# Altium schematic sheet Motors.SchDoc
size OrCAD A
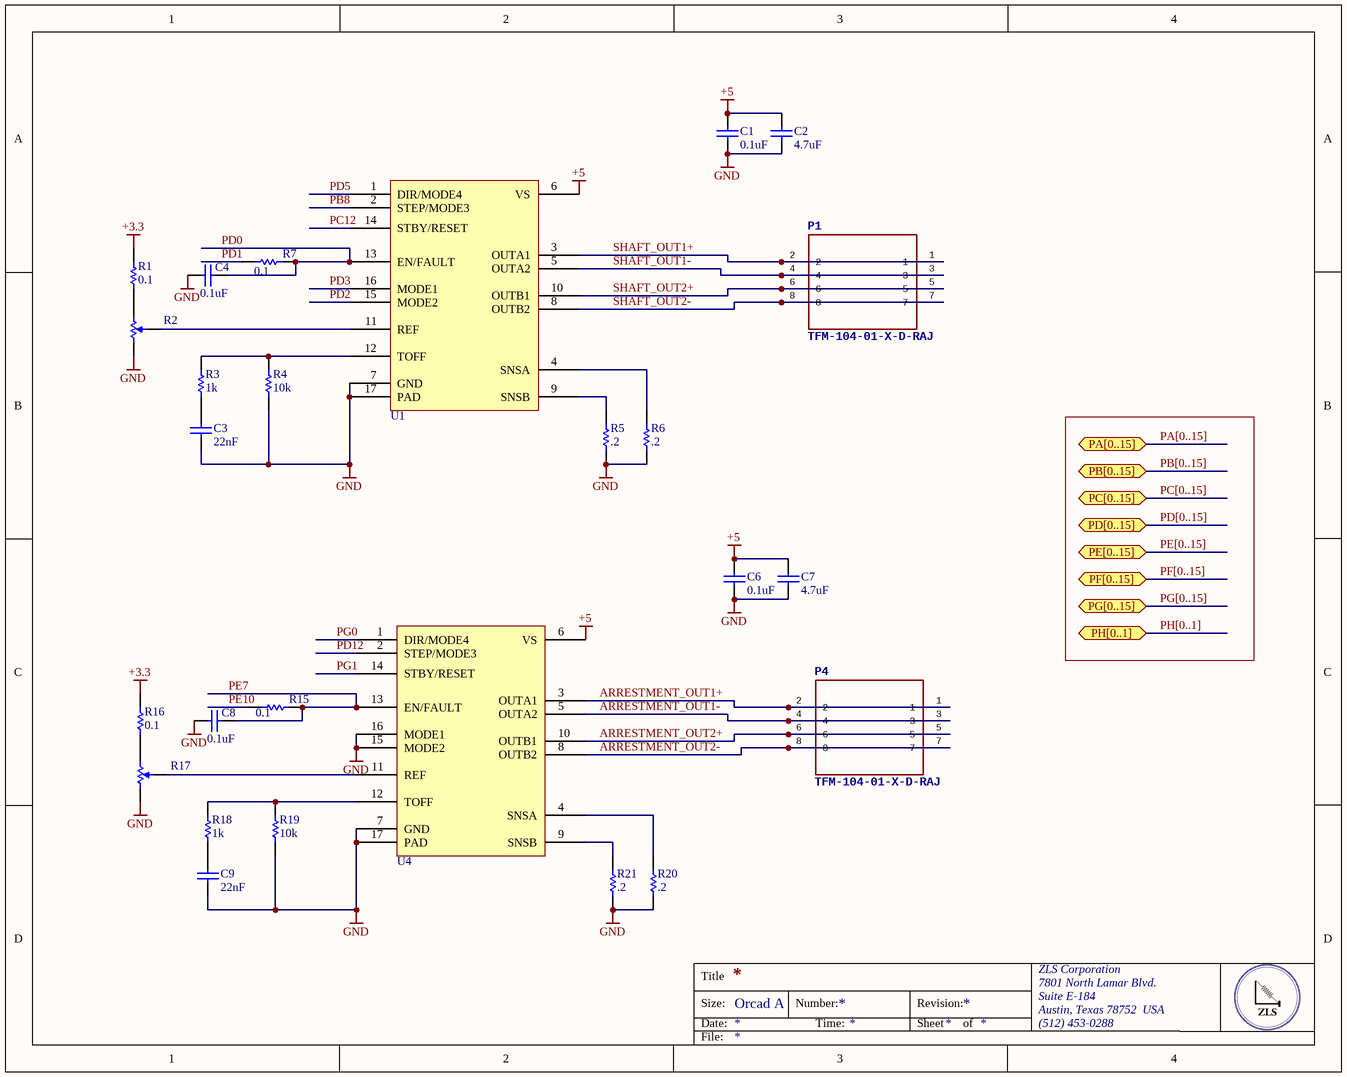
[diagram p0: Motors.SchDoc]

## Parts
C1  0.1uF  [CAPC1608X94X35LL15T15]
C2  4.7uF  [CAPC0603(1608)55_M]
C3  22nF  [CAPC1608X94X35LL15T15]
C4  0.1uF  [CAPC1608X94X35LL15T15]
C6  0.1uF  [CAPC1608X94X35LL15T15]
C7  4.7uF  [CAPC0603(1608)55_M]
C8  0.1uF  [CAPC1608X94X35LL15T15]
C9  22nF  [CAPC1608X94X35LL15T15]
P1  TFM-104-01-X-D-RAJ  [SAMTEC-TFM-104-01-X-D-RA]
P4  TFM-104-01-X-D-RAJ  [SAMTEC-TFM-104-01-X-D-RA]
R1  0.1  [RESC0603(1608)_N]
R2  3313J-1-503E  [BOUR-3313J-1_V]  (value not drawn)
R3  1k  [RESC0603(1608)_N]
R4  10k  [RESC0603(1608)_N]
R5  .2  [RESC0603(1608)_N]
R6  .2  [RESC0603(1608)_N]
R7  0.1  [RESC0603(1608)_N]
R15  0.1  [RESC0603(1608)_N]
R16  0.1  [RESC0603(1608)_N]
R17  3313J-1-503E  [BOUR-3313J-1_V]  (value not drawn)
R18  1k  [RESC0603(1608)_N]
R19  10k  [RESC0603(1608)_N]
R20  .2  [RESC0603(1608)_N]
R21  .2  [RESC0603(1608)_N]
U1  STSPIN220  [STSPIN220-QFN127P600-8N]  (value not drawn)
U4  STSPIN220  [STSPIN220-QFN127P600-8N]  (value not drawn)

## Ports
PA[0..15] (bidir), PB[0..15] (bidir), PC[0..15] (bidir), PD[0..15] (bidir), PE[0..15] (bidir), PF[0..15] (bidir), PG[0..15] (bidir), PH[0..1] (bidir)

## Nets
+3.3: R1.1 R16.1
+5: C1.1 C2.2 C6.1 C7.2 U1.6(VS) U4.6(VS)
GND: C1.2 C2.1 C3.2 C4.1 C6.2 C7.1 C8.1 C9.2 R2.1 R4.1 R5.1 R6.1 R17.1 R19.1 R20.1 R21.1 U1.7(GND) U1.17(PAD) U4.7(GND) U4.15(MODE2) U4.16(MODE1) U4.17(PAD)
ARRESTMENT_OUT1+: P4.1 P4.2 U4.3(OUTA1)
ARRESTMENT_OUT1-: P4.3 P4.4 U4.5(OUTA2)
ARRESTMENT_OUT2+: P4.5 P4.6 U4.10(OUTB1)
ARRESTMENT_OUT2-: P4.7 P4.8 U4.8(OUTB2)
PB8: U1.2(STEP/MODE3)
PC12: U1.14(STBY/RESET)
PD0: C4.2 R7.1 U1.13(EN/FAULT)
PD1: R7.2
PD2: U1.15(MODE2)
PD3: U1.16(MODE1)
PD5: U1.1(DIR/MODE4)
PD12: U4.2(STEP/MODE3)
PE7: C8.2 R15.1 U4.13(EN/FAULT)
PE10: R15.2
PG0: U4.1(DIR/MODE4)
PG1: U4.14(STBY/RESET)
SHAFT_OUT1+: P1.1 P1.2 U1.3(OUTA1)
SHAFT_OUT1-: P1.3 P1.4 U1.5(OUTA2)
SHAFT_OUT2+: P1.5 P1.6 U1.10(OUTB1)
SHAFT_OUT2-: P1.7 P1.8 U1.8(OUTB2)
NetC3_1: C3.1 R3.1
NetC9_1: C9.1 R18.1
NetR1_2: R1.2 R2.3
NetR2_2: R2.2 U1.11(REF)
NetR3_2: R3.2 R4.2 U1.12(TOFF)
NetR5_2: R5.2 U1.9(SNSB)
NetR6_2: R6.2 U1.4(SNSA)
NetR16_2: R16.2 R17.3
NetR17_2: R17.2 U4.11(REF)
NetR18_2: R18.2 R19.2 U4.12(TOFF)
NetR20_2: R20.2 U4.4(SNSA)
NetR21_2: R21.2 U4.9(SNSB)

## Buses and harness runs
bus PA[0..15] = port PA[0..15]
bus PB[0..15] = port PB[0..15]
bus PC[0..15] = port PC[0..15]
bus PD[0..15] = port PD[0..15]
bus PE[0..15] = port PE[0..15]
bus PF[0..15] = port PF[0..15]
bus PG[0..15] = port PG[0..15]
bus PH[0..1] = port PH[0..1]

## Notes on the sheet
- Title
- Size:
- Date:
- Orcad A
- Number:
- Time:
- Revision:
- Sheet
- of
- ZLS Corporation
- 7801 North Lamar Blvd.
- Suite E-184
- Austin, Texas 78752  USA
- (512) 453-0288
- File:

## Library data of the parts
C1 C3 C4 C6 C8 C9 = CMP-1661-00001-2: CAP .1UF 16V CERAMIC X7R 0603; Manufacturer: Yageo; Manufacturer Part Number: CC0603KRX7R7BB105; Capacitance: 1uF; Tolerance: 10%; Dissipation Factor: 5%; ComponentLink1Description: Datasheet; ComponentLink1URL: http://datasheets.avx.com/X7RDielectric.pdf; Supplier 1: Digi-Key; Supplier Part Number 1: 311-1446-6-ND; Stock 1: 5506121; Pricing 1: 1=0.21, 10=0.143, 100=0.0727, 500=0.04974, 1000=0.044 (USD); Mount: Surface Mount; Case/Package: 0603; Number of Pins: 2; Case Code (Metric): 1608; Case Code (Imperial): 0603; Min Operating Temperature: -55°C; Max Operating Temperature: 125°C; Voltage Rating: 16V; Package Quantity: 1; Packaging: Tape and Reel; Voltage Rating (DC): 16V; Dielectric: X7R; Termination: SMD/SMT; Voltage: 16V; Composition: Ceramic; Length: 1.6mm; Height: 0.8mm; Width: 0.031inch; Thickness: 0.035inch; Depth: 0.8mm; Radiation Hardening: No; REACH SVHC: Unknown; Lead Free: Lead Free; Halogen Free: Halogen Free; ComponentLink2URL: http://www.yageo.com/documents/recent/UPY-GPHC_X7R_6.3V-to-50V_18.pdf; ComponentLink2Description: http://www.yageo.com/documents/recent/UPY-GPHC_X7R_6.3V-to-50V_18.pdf; ComponentLink3URL: http://www.yageo.com/documents/recent/UPY-GPHC_X7R_6.3V-to-50V_8.pdf; ComponentLink3Description: http://www.yageo.com/documents/recent/UPY-GPHC_X7R_6.3V-to-50V_8.pdf; ComponentLink4URL: http://www.farnell.com/datasheets/1734573.pdf; ComponentLink4Description: http://www.farnell.com/datasheets/1734573.pdf; ComponentLink5URL: http://www.farnell.com/datasheets/1489800.pdf; ComponentLink5Description: http://www.farnell.com/datasheets/1489800.pdf
C2 C7 = CMP-1035-02779-1: CAP 4.7uF 6.3V ±10% 0603 (1608 Metric) Thickness 0.55mm SMD; Manufacturer: KEMET; Manufacturer Part Number: C0603C475K9PACTU; Case-EIA: 0603; Tolerance: Â±10%; Case-Metric: 1608; Dielectric Material: Ceramic; Dielectric: X5R; Dissipation Factor: 5%; Technology: SMT; Value: 4.7uF; Max Thickness: 0.55 mm; Rated Voltage: 6.3 V; Supplier 1: Digi-Key; Supplier Part Number 1: 399-3482-6-ND; Stock 1: 1765509; Pricing 1: 1=0.21, 10=0.15, 100=0.0706, 500=0.04952, 1000=0.041 (USD); Mount: PCB,Surface Mount; Case/Package: 0603; Number of Pins: 2; Case Code (Metric): 1608; Case Code (Imperial): 0603; Contact Plating: Matte,Tin; Min Operating Temperature: -55°C; Max Operating Temperature: 85°C; Package Quantity: 1; Capacitance: 4.7uF; Voltage Rating: 6.3V; Packaging: Tape and Reel; Termination: SMD/SMT; Voltage Rating (DC): 6.3V; Voltage: 6.3V; Length: 1.6mm; Height: 0.8mm; Width: 0.031inch; Thickness: 0.035inch; Depth: 0.8mm; Lead Pitch: 0.7mm; Radiation Hardening: No; Lead Free: Lead Free; REACH SVHC: No SVHC; ComponentLink1URL: https://api.kemet.com/component-edge/download/datasheet/C0603C475K9PACTU.pdf; ComponentLink1Description: https://api.kemet.com/component-edge/download/datasheet/C0603C475K9PACTU.pdf; ComponentLink2URL: http://www.farnell.com/datasheets/1732700.pdf; ComponentLink2Description: http://www.farnell.com/datasheets/1732700.pdf; ComponentLink3URL: http://www.farnell.com/datasheets/1789732.pdf; ComponentLink3Description: http://www.farnell.com/datasheets/1789732.pdf; ComponentLink4URL: http://www.farnell.com/datasheets/40889.pdf; ComponentLink4Description: http://www.farnell.com/datasheets/40889.pdf
P1 P4 = SAMTEC-TFM-104-01-X-D-RAJ: Manufacturer: SAMTEC; Manufacturer Part Number: TFM-104-01-X-D-RAJ
R1 R7 R15 R16 = CMP-1012-00511-1: RES 0.1 OHM 1% 1/10W 0603; Manufacturer: Bourns; Manufacturer Part Number: CRL0603-FW-R100ELF; Resistance: 100mR; Temperature Coefficient: 200ppm/°C; Power Rating: 100mW; ComponentLink1URL: http://www.vishay.com/docs/20008/dcrcw.pdf; ComponentLink1Description: http://www.vishay.com/docs/20008/dcrcw.pdf; ComponentLink2URL: https://www.verical.com/server-webapp/html/getDatasheet?partID=86831; ComponentLink2Description: https://www.verical.com/server-webapp/html/getDatasheet?partID=86831; ComponentLink3URL: http://www.farnell.com/datasheets/2310790.pdf; ComponentLink3Description: http://www.farnell.com/datasheets/2310790.pdf; ComponentLink4URL: http://www.vishay.com/docs/20035/dcrcwe3.pdf; ComponentLink4Description: http://www.vishay.com/docs/20035/dcrcwe3.pdf; ComponentLink5URL: http://www.farnell.com/datasheets/2111203.pdf; ComponentLink5Description: http://www.farnell.com/datasheets/2111203.pdf; ComponentLink6URL: http://uk.rs-online.com/webdocs/0d98/0900766b80d98afc.pdf; ComponentLink6Description: http://uk.rs-online.com/webdocs/0d98/0900766b80d98afc.pdf; Supplier 1: Digi-Key; Supplier Part Number 1: CRL0603-FW-R100ELFCT-ND; Stock 1: 25237; Pricing 1: 1=0.40000, 10=0.28500, 100=0.11400, 1000=0.05616, 2500=0.05203 (USD); RoHS: Yes; Mount: Surface Mount; Case/Package: 0603; Number of Pins: 2; Contact Plating: Tin; Case Code (Imperial): 0603; Case Code (Metric): 1608; Min Operating Temperature: -55°C; Max Operating Temperature: 125°C; Tolerance: 1%; Composition: Thick Film; Packaging: Tape and Reel; Package Quantity: 1; Termination: SMD/SMT; Number of Terminations: 2; Military Standard: Not; Max Power Dissipation: 100mW; Length: 1.6mm; Height: 0.45mm; Width: 0.8mm; Depth: 0.8mm; Radiation Hardening: No; REACH SVHC: No SVHC; ComponentLink7URL: https://datasheet.ciiva.com/11821/0900766b80fcdbbc-11821107.pdf?src-supplier=RSComponents; ComponentLink7Description: https://datasheet.ciiva.com/11821/0900766b80fcdbbc-11821107.pdf?src-supplier=RSComponents; ComponentLink8URL: https://datasheet.ciiva.com/9120/crl-9120710.pdf?src-supplier=Avnet; ComponentLink8Description: https://datasheet.ciiva.com/9120/crl-9120710.pdf?src-supplier=Avnet; ComponentLink9URL: https://datasheet.ciiva.com/6548/crl-6548261.pdf?src-supplier=Digi-Key; ComponentLink9Description: https://datasheet.ciiva.com/6548/crl-6548261.pdf?src-supplier=Digi-Key; ComponentLink10URL: https://datasheet.ciiva.com/6548/crl-6548262.pdf?src-supplier=Digi-Key; ComponentLink10Description: https://datasheet.ciiva.com/6548/crl-6548262.pdf?src-supplier=Digi-Key; ComponentLink11URL: https://datasheet.ciiva.com/22693/1896411-22693272.pdf?src-supplier=Element14; ComponentLink11Description: https://datasheet.ciiva.com/22693/1896411-22693272.pdf?src-supplier=Element14; ComponentLink12URL: https://datasheet.ciiva.com/16929/crl-16929692.pdf?src-supplier=Avnet+Europe; ComponentLink12Description: https://datasheet.ciiva.com/16929/crl-16929692.pdf?src-supplier=Avnet+Europe
R2 R17 = CMP-2000-05588-1: 3 mm Trimpot(R) Trimming Potentiometer, 50 KOhm, +/- 20%, 0.125 W, -55 to 125 degC, 3-Pin SMD, RoHS, Tape and Reel; Manufacturer: Bourns; SVHC: NoSVHC(19-Dec-2012); Temperature Coefficient: ±150ppm/°C; No. of Turns: 1; Power Rating: 125mW; Track Resistance: 50kohm; Resistance: 50kR; Voltage Rating: 200V; Insulation Resistance: 100MR; Manufacturer URL: http://www.bourns.com/; Potentiometer Mounting: SMD; Package Description: 3-Pin Surface Mount Device, Body 3.5 x 3.2 mm, Pitch 1.15 mm; Package Reference: 3313J-1; Mounting Technology: SurfaceMount; Resistance Tolerance: ±20%; Datasheet Version: 05/2016; Datasheet URL: http://www.bourns.com/docs/Product-Datasheets/3313.pdf; Supplier 1: Digi-Key; Supplier Part Number 1: 3313J-503ECT-ND; Manufacturer Part Number: 3313J-1-503E; Stock 1: 7500; Pricing 1: 1=2.18000, 10=1.91400, 25=1.71600, 50=1.65000, 100=1.58400, 250=1.51800, 500=1.25400 (USD); RoHS: Yes; Mount: Surface Mount; Weight: 0.283g; Color: Natural; Min Operating Temperature: -55°C; Max Operating Temperature: 125°C; Tolerance: 20%; Packaging: Tape and Reel; Composition: Cermet,Potentiometer; Termination: J-Hook; Number of Turns: 1; Military Standard: Not; Package Quantity: 1; Taper: Linear; Max Power Dissipation: 125mW; Voltage Rating (DC): 200V; Type: Potentiometer; Length: 3.2mm; Height: 2.2mm; Depth: 3.5mm; Width: 0.126inch; Radiation Hardening: No; REACH SVHC: No SVHC; ComponentLink1URL: https://datasheet.ciiva.com/11832/0900766b80dbb89c-11832361.pdf?src-supplier=RSComponents; ComponentLink1Description: https://datasheet.ciiva.com/11832/0900766b80dbb89c-11832361.pdf?src-supplier=RSComponents; ComponentLink2URL: https://datasheet.ciiva.com/36525/1157579-36525954.pdf?src-supplier=Jameco; ComponentLink2Description: https://datasheet.ciiva.com/36525/1157579-36525954.pdf?src-supplier=Jameco; ComponentLink3URL: https://datasheet.ciiva.com/2156/3313-2156361.pdf?src-supplier=Digi-Key; ComponentLink3Description: https://datasheet.ciiva.com/2156/3313-2156361.pdf?src-supplier=Digi-Key; ComponentLink4URL: https://datasheet.ciiva.com/2156/3313-2156362.pdf?src-supplier=Digi-Key; ComponentLink4Description: https://datasheet.ciiva.com/2156/3313-2156362.pdf?src-supplier=Digi-Key; ComponentLink5URL: https://datasheet.ciiva.com/15225/getdatasheetpartid-156979-15225194.pdf?src-supplier=Verical; ComponentLink5Description: https://datasheet.ciiva.com/15225/getdatasheetpartid-156979-15225194.pdf?src-supplier=Verical; ComponentLink6URL: https://datasheet.ciiva.com/7400/1864507-7400716.pdf?src-supplier=Newark; ComponentLink6Description: https://datasheet.ciiva.com/7400/1864507-7400716.pdf?src-supplier=Newark; ComponentLink7URL: https://datasheet.ciiva.com/1477/327479-1477560.pdf?src-supplier=Element14; ComponentLink7Description: https://datasheet.ciiva.com/1477/327479-1477560.pdf?src-supplier=Element14; ComponentLink8URL: https://datasheet.ciiva.com/2156/3313-2156360.pdf?src-supplier=Digi-Key; ComponentLink8Description: https://datasheet.ciiva.com/2156/3313-2156360.pdf?src-supplier=Digi-Key; ComponentLink9URL: https://datasheet.ciiva.com/3266/3313-3266265.pdf?src-supplier=Avnet; ComponentLink9Description: https://datasheet.ciiva.com/3266/3313-3266265.pdf?src-supplier=Avnet; ComponentLink10URL: https://datasheet.ciiva.com/6197/327479-6197404.pdf?src-supplier=Farnell; ComponentLink10Description: https://datasheet.ciiva.com/6197/327479-6197404.pdf?src-supplier=Farnell; ComponentLink11URL: https://datasheet.ciiva.com/30157/9433313-30157869.pdf?src-supplier=Onlinecomponents.com; ComponentLink11Description: https://datasheet.ciiva.com/30157/9433313-30157869.pdf?src-supplier=Onlinecomponents.com; ComponentLink12URL: https://datasheet.ciiva.com/48714/001055020-da-01-en-smd-trimm-3313j-1-503e-50k-ohm-0-125w-48714997.pdf?src-supplier=Conrad; ComponentLink12Description: https://datasheet.ciiva.com/48714/001055020-da-01-en-smd-trimm-3313j-1-503e-50k-ohm-0-125w-48714997.pdf?src-supplier=Conrad
R3 R18 = CMP-1012-00511-1: RES SMD 1K OHM 0.1% 1/10W 0603; Manufacturer: Panasonic; Manufacturer Part Number: ERA-3AEB102V; Resistance: 1kR; Power Rating: 100mW; Temperature Coefficient: 25ppm/°C; Voltage Rating: 75V; ComponentLink1URL: http://www.vishay.com/docs/20008/dcrcw.pdf; ComponentLink1Description: http://www.vishay.com/docs/20008/dcrcw.pdf; ComponentLink2URL: https://www.verical.com/server-webapp/html/getDatasheet?partID=86831; ComponentLink2Description: https://www.verical.com/server-webapp/html/getDatasheet?partID=86831; ComponentLink3URL: http://www.farnell.com/datasheets/2310790.pdf; ComponentLink3Description: http://www.farnell.com/datasheets/2310790.pdf; ComponentLink4URL: http://www.vishay.com/docs/20035/dcrcwe3.pdf; ComponentLink4Description: http://www.vishay.com/docs/20035/dcrcwe3.pdf; ComponentLink5URL: http://www.farnell.com/datasheets/2111203.pdf; ComponentLink5Description: http://www.farnell.com/datasheets/2111203.pdf; ComponentLink6URL: http://uk.rs-online.com/webdocs/0d98/0900766b80d98afc.pdf; ComponentLink6Description: http://uk.rs-online.com/webdocs/0d98/0900766b80d98afc.pdf; Supplier 1: Digi-Key; Supplier Part Number 1: P1.0KDBCT-ND; Stock 1: 843980; Pricing 1: 1=0.35000, 10=0.30000, 100=0.11720, 1000=0.04906, 2500=0.04498 (USD); RoHS: Yes; Mount: Surface Mount; Case/Package: 0603; Number of Pins: 2; Case Code (Imperial): 0603; Case Code (Metric): 1608; Contact Plating: Tin; Min Operating Temperature: -55°C; Max Operating Temperature: 155°C; Tolerance: 0.1%; Packaging: Tape and Reel; Composition: Thin Film; Termination: SMD/SMT; Military Standard: Not; Number of Terminations: 2; Package Quantity: 5000; Max Power Dissipation: 100mW; Length: 1.6mm; Height: 0.45mm; Width: 0.8mm; Depth: 0.8mm; Radiation Hardening: No; REACH SVHC: No SVHC; ComponentLink7URL: https://datasheet.ciiva.com/11808/0900766b80fe20f7-11808019.pdf?src-supplier=RSComponents; ComponentLink7Description: https://datasheet.ciiva.com/11808/0900766b80fe20f7-11808019.pdf?src-supplier=RSComponents; ComponentLink8URL: https://datasheet.ciiva.com/29183/450752-da-01-en-widerstand-0603-era-29183754.pdf?src-supplier=Conrad; ComponentLink8Description: https://datasheet.ciiva.com/29183/450752-da-01-en-widerstand-0603-era-29183754.pdf?src-supplier=Conrad; ComponentLink9URL: https://datasheet.ciiva.com/24071/aoa0000ce26-197354-24071510.pdf?src-supplier=Mouser; ComponentLink9Description: https://datasheet.ciiva.com/24071/aoa0000ce26-197354-24071510.pdf?src-supplier=Mouser; ComponentLink10URL: https://datasheet.ciiva.com/48530/era-eng-tds-48530582.pdf?src-supplier=Distrelec; ComponentLink10Description: https://datasheet.ciiva.com/48530/era-eng-tds-48530582.pdf?src-supplier=Distrelec; ComponentLink11URL: https://datasheet.ciiva.com/16781/70068849-16781703.pdf?src-supplier=Allied+Electronics; ComponentLink11Description: https://datasheet.ciiva.com/16781/70068849-16781703.pdf?src-supplier=Allied+Electronics; ComponentLink12URL: https://datasheet.ciiva.com/46422/1776116-46422455.pdf?src-supplier=Element14; ComponentLink12Description: https://datasheet.ciiva.com/46422/1776116-46422455.pdf?src-supplier=Element14; ComponentLink13URL: https://datasheet.ciiva.com/46422/485442-46422519.pdf?src-supplier=Element14; ComponentLink13Description: https://datasheet.ciiva.com/46422/485442-46422519.pdf?src-supplier=Element14; ComponentLink14URL: https://datasheet.ciiva.com/28531/485442-28531944.pdf?src-supplier=Element14; ComponentLink14Description: https://datasheet.ciiva.com/28531/485442-28531944.pdf?src-supplier=Element14; ComponentLink15URL: https://datasheet.ciiva.com/16426/aoa0000ce26-16426809.pdf?src-supplier=Future+Electronics; ComponentLink15Description: https://datasheet.ciiva.com/16426/aoa0000ce26-16426809.pdf?src-supplier=Future+Electronics; ComponentLink16URL: https://datasheet.ciiva.com/5734/aoa0000ce26-5734524.pdf?src-supplier=Farnell; ComponentLink16Description: https://datasheet.ciiva.com/5734/aoa0000ce26-5734524.pdf?src-supplier=Farnell; ComponentLink17URL: https://datasheet.ciiva.com/9198/aoa0000ce26-9198972.pdf?src-supplier=Avnet; ComponentLink17Description: https://datasheet.ciiva.com/9198/aoa0000ce26-9198972.pdf?src-supplier=Avnet; ComponentLink18URL: https://datasheet.ciiva.com/5734/485442-5734525.pdf?src-supplier=Farnell; ComponentLink18Description: https://datasheet.ciiva.com/5734/485442-5734525.pdf?src-supplier=Farnell; ComponentLink19URL: https://datasheet.ciiva.com/16725/70068849-16725038.pdf?src-supplier=Allied+Electronics; ComponentLink19Description: https://datasheet.ciiva.com/16725/70068849-16725038.pdf?src-supplier=Allied+Electronics; ComponentLink20URL: https://datasheet.ciiva.com/16853/aoa0000ce26-16853231.pdf?src-supplier=Avnet+Europe; ComponentLink20Description: https://datasheet.ciiva.com/16853/aoa0000ce26-16853231.pdf?src-supplier=Avnet+Europe; ComponentLink21URL: https://datasheet.ciiva.com/46393/1776116-46393695.pdf?src-supplier=Element14; ComponentLink21Description: https://datasheet.ciiva.com/46393/1776116-46393695.pdf?src-supplier=Element14
R4 R19 = CMP-1012-00511-1: 0R12 0.1W 1% 0603 (1608 Metric)  SMD; Manufacturer: Vishay; Manufacturer Part Number: CRCW060310K0FKEA; Value: 1020.00 Ohm; Case-EIA: 0603; Case-Metric: 1608; Resistance: 10kR; Power Rating: 100mW; Voltage Rating: 75V; Temperature Coefficient: 100ppm/°C; Technology: SMT; Power: 0.1 W; Tolerance: 1 %; Supplier 1: Digi-Key; Supplier Part Number 1: 311-0.0GRDKR-ND; Stock 1: 49641653; Pricing 1: 1=0.1, 10=0.021, 25=0.0152, 50=0.0114, 100=0.0084, 250=0.00644, 500=0.00514, 1000=0.00379 (USD); Case/Package: 0603; Number of Pins: 2; Weight: 7.1E-05oz; Case Code (Metric): 1608; Case Code (Imperial): 0603; Contact Plating: Lead,Tin; Min Operating Temperature: -55°C; Max Operating Temperature: 155°C; Packaging: Tape and Reel; Package Quantity: 10; Composition: Thick Film; Military Standard: Not; Termination: SMD/SMT; Voltage Rating (DC): 75V; Number of Terminations: 2; Max Power Dissipation: 100mW; Features: Automotive AEC-Q200; Length: 1.55mm; Height: 0.45mm; Width: 0.033inch; Depth: 0.85mm; Radiation Hardening: No; REACH SVHC: Unknown; Lead Free: Lead Free; ComponentLink1URL: http://www.vishay.com/docs/20008/dcrcw.pdf; ComponentLink1Description: http://www.vishay.com/docs/20008/dcrcw.pdf; ComponentLink2URL: https://www.verical.com/server-webapp/html/getDatasheet?partID=86831; ComponentLink2Description: https://www.verical.com/server-webapp/html/getDatasheet?partID=86831; ComponentLink3URL: http://www.farnell.com/datasheets/2310790.pdf; ComponentLink3Description: http://www.farnell.com/datasheets/2310790.pdf; ComponentLink4URL: http://www.vishay.com/docs/20035/dcrcwe3.pdf; ComponentLink4Description: http://www.vishay.com/docs/20035/dcrcwe3.pdf; ComponentLink5URL: http://www.farnell.com/datasheets/2111203.pdf; ComponentLink5Description: http://www.farnell.com/datasheets/2111203.pdf; ComponentLink6URL: http://uk.rs-online.com/webdocs/0d98/0900766b80d98afc.pdf; ComponentLink6Description: http://uk.rs-online.com/webdocs/0d98/0900766b80d98afc.pdf
R5 R6 R20 R21 = CMP-1012-00511-1: RES 0.1W 1% 0603 (1608 Metric)  SMD; Manufacturer: Bourns; Manufacturer Part Number: CRL0603-FW-R200ELF; Resistance: 200mR; Temperature Coefficient: 200ppm/°C; Power Rating: 100mW; ComponentLink1URL: http://www.vishay.com/docs/20008/dcrcw.pdf; ComponentLink1Description: http://www.vishay.com/docs/20008/dcrcw.pdf; ComponentLink2URL: https://www.verical.com/server-webapp/html/getDatasheet?partID=86831; ComponentLink2Description: https://www.verical.com/server-webapp/html/getDatasheet?partID=86831; ComponentLink3URL: http://www.farnell.com/datasheets/2310790.pdf; ComponentLink3Description: http://www.farnell.com/datasheets/2310790.pdf; ComponentLink4URL: http://www.vishay.com/docs/20035/dcrcwe3.pdf; ComponentLink4Description: http://www.vishay.com/docs/20035/dcrcwe3.pdf; ComponentLink5URL: http://www.farnell.com/datasheets/2111203.pdf; ComponentLink5Description: http://www.farnell.com/datasheets/2111203.pdf; ComponentLink6URL: http://uk.rs-online.com/webdocs/0d98/0900766b80d98afc.pdf; ComponentLink6Description: http://uk.rs-online.com/webdocs/0d98/0900766b80d98afc.pdf; Supplier 1: Digi-Key; Supplier Part Number 1: CRL0603-FW-R200ELFCT-ND; Stock 1: 471; Pricing 1: 1=0.40000, 10=0.28500, 100=0.11400, 1000=0.05616, 2500=0.05203 (USD); RoHS: Yes; Mount: Surface Mount; Case/Package: 0603; Number of Pins: 2; Contact Plating: Tin; Case Code (Metric): 1608; Case Code (Imperial): 0603; Min Operating Temperature: -55°C; Max Operating Temperature: 125°C; Tolerance: 1%; Composition: Thick Film; Package Quantity: 5000; Packaging: Tape and Reel; Number of Terminations: 2; Termination: SMD/SMT; Military Standard: Not; Max Power Dissipation: 100mW; Length: 1.6mm; Height: 0.45mm; Width: 0.031inch; Depth: 0.8mm; Radiation Hardening: No; REACH SVHC: No SVHC; ComponentLink7URL: https://datasheet.ciiva.com/16929/crl-16929701.pdf?src-supplier=Avnet+Europe; ComponentLink7Description: https://datasheet.ciiva.com/16929/crl-16929701.pdf?src-supplier=Avnet+Europe; ComponentLink8URL: https://datasheet.ciiva.com/9120/crl-9120264.pdf?src-supplier=Avnet; ComponentLink8Description: https://datasheet.ciiva.com/9120/crl-9120264.pdf?src-supplier=Avnet
U1 U4 = STSPIN220: Bipolar Motor Driver Power MOSFET Step/Direction 16-VFQFPN (3x3); Manufacturer: STMicroelectronics; Description: LOW VOLTAGE STEPPER MOTOR DRIVER; Supplier 1: Digi-Key; Supplier Part Number 1: 497-16602-1-ND; Manufacturer Part Number: STSPIN220; Stock 1: 3719; Pricing 1: 1=2.60000, 10=2.33400, 100=1.87580, 500=1.54114, 1000=1.27694 (USD); RoHS: No; ComponentLink1URL: http://www.st.com/content/ccc/resource/technical/document/datasheet/group3/42/7e/5c/90/70/ef/47/95/DM00291865/files/DM00291865.pdf/jcr:content/translations/en.DM00291865.pdf?src-supplier=Digi-Key; ComponentLink1Description: http://www.st.com/content/ccc/resource/technical/document/datasheet/group3/42/7e/5c/90/70/ef/47/95/DM00291865/files/DM00291865.pdf/jcr:content/translations/en.DM00291865.pdf?src-supplier=Digi-Key